# EAGLE design ESP32_Dev_2018-2 (EAGLE 9.2.0)
COMPANY: UNEXPECTED MAKER; DRAWN: SEON; REV: A
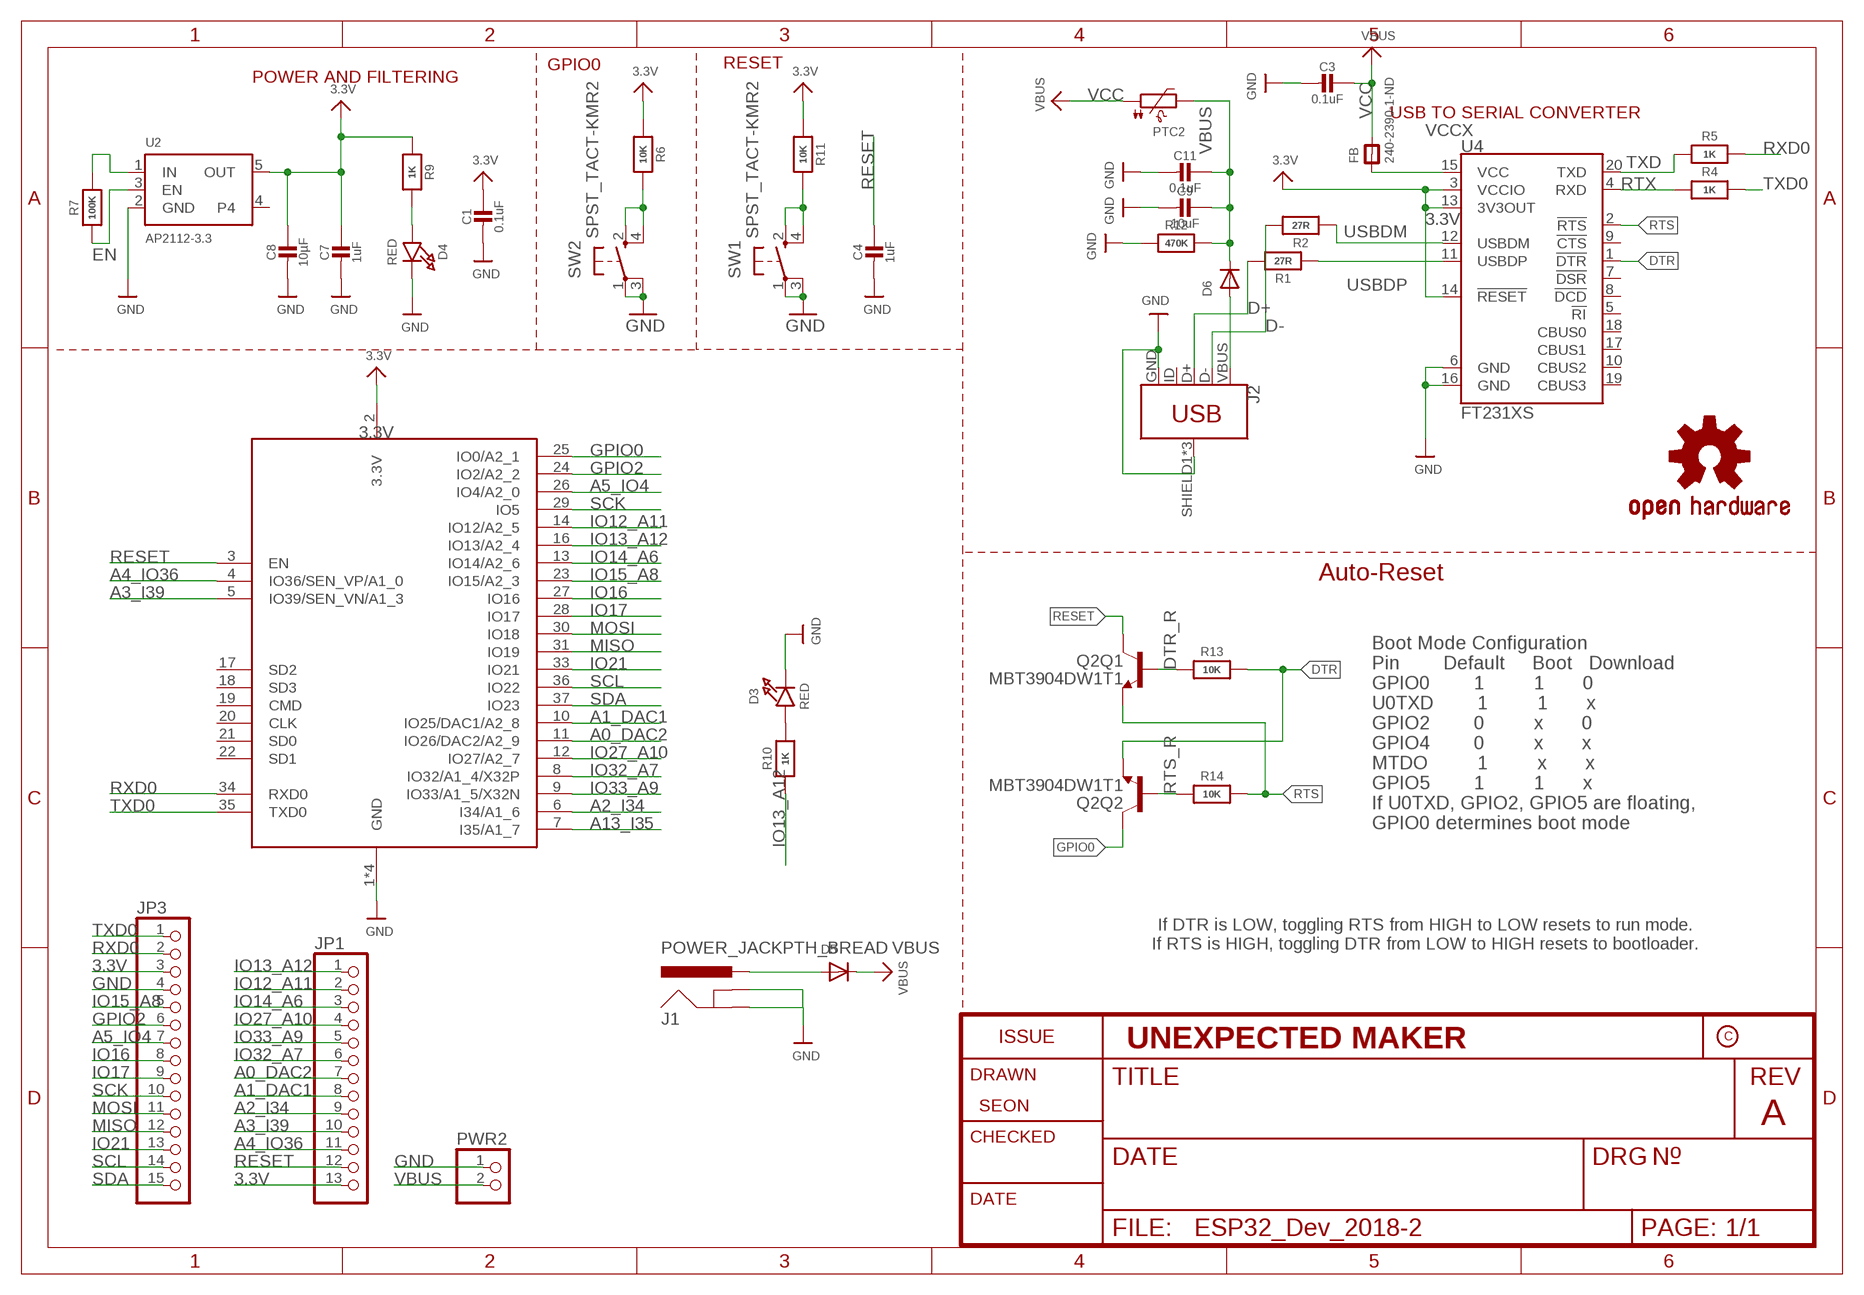
[diagram p0: schematic, sheet 1]

## Parts
C1  0.1uF  CAP_CERAMIC0805-NOOUTLINE  [0805-NO]
C3  0.1uF  CAP_CERAMIC0805-NOOUTLINE  [0805-NO]
C4  1uF  CAP_CERAMIC0805-NOOUTLINE  [0805-NO]
C7  1uF  CAP_CERAMIC0805-NOOUTLINE  [0805-NO]
C8  10µF  CAP_CERAMIC0805-NOOUTLINE  [0805-NO]
C9  10uF  CAP_CERAMIC0805-NOOUTLINE  [0805-NO]
C11  0.1uF  CAP_CERAMIC0805-NOOUTLINE  [0805-NO]
D3  RED  LED0805_NOOUTLINE  [CHIPLED_0805_NOOUTLINE]
D4  RED  LED0805_NOOUTLINE  [CHIPLED_0805_NOOUTLINE]
D5  DIODESOD-123  [SOD-123]
D6  DIODESOD-123  [SOD-123]
FB  240-2390-1-ND  FERRITE_0805  [_0805]
J1  POWER_JACKPTH_BREAD  [POWER_JACK_PTH_BREAD]
J2  USB_MICRO-BREDUCED_PASTE  [USB-B-MICRO-SMD_RED_PASTE]
JP1  HEADER-1X13  [1X13_ROUND_70]
JP3  HEADER-1X15  [1X15_ROUND_70]
LOGO1  OSHW-LOGOM  [OSHW-LOGO-M]
PTC2  PTC1206  [1206]
PWR2  HEADER-1X2ROUND  [1X02_ROUND]
Q2  MBT3904DW1T1  [SC70-6]
R1  27R  RESISTOR0805_NOOUTLINE  [0805-NO]
R2  27R  RESISTOR0805_NOOUTLINE  [0805-NO]
R4  1K  RESISTOR0805_NOOUTLINE  [0805-NO]
R5  1K  RESISTOR0805_NOOUTLINE  [0805-NO]
R6  10K  RESISTOR0805_NOOUTLINE  [0805-NO]
R7  100K  RESISTOR0805_NOOUTLINE  [0805-NO]
R9  1K  RESISTOR0805_NOOUTLINE  [0805-NO]
R10  1K  RESISTOR0805_NOOUTLINE  [0805-NO]
R11  10K  RESISTOR0805_NOOUTLINE  [0805-NO]
R12  470K  RESISTOR0805_NOOUTLINE  [0805-NO]
R13  10K  RESISTOR0805_NOOUTLINE  [0805-NO]
R14  10K  RESISTOR0805_NOOUTLINE  [0805-NO]
SW1  SPST_TACT-KMR2  [KMR2]
SW2  SPST_TACT-KMR2  [KMR2]
U2  AP2112-3.3  VREG_SOT23-5  [SOT23-5]
U4  FT231XS  [SSOP20_L]
X2  ESP32_WROOM32  [WROOM32]

## Nets
3.3V: C1.1 C7.1 C8.1 JP1.13 JP3.3 R6.1 R9.1 R11.1 U2.5(OUT) U4.3(VCCIO) U4.13(3V3OUT) U4.14(!RESET) X2.2(3.3V)
A0_DAC2: JP1.7 X2.11(IO26/DAC2/A2_9)
A1_DAC1: JP1.8 X2.10(IO25/DAC1/A2_8)
A2_I34: JP1.9 X2.6(I34/A1_6)
A3_I39: JP1.10 X2.5(IO39/SEN_VN/A1_3)
A4_IO36: JP1.11 X2.4(IO36/SEN_VP/A1_0)
A5_IO4: JP3.7 X2.26(IO4/A2_0)
A13_I35: X2.7(I35/A1_7)
D+: J2.D+ R1.2
D-: J2.D- R2.2
DTR: Q2.1(Q2:E) R13.2 U4.1(!DTR)
DTR_R: Q2.5(Q1:B) R13.1
EN: R7.1 U2.3(EN)
GND: C1.2 C3.2 C4.2 C7.2 C8.2 C9.2 C11.2 D3.C D4.C J1.GND J1.GNDBREAK J2.GND J2.SHIELD1(SHIELD) J2.SHIELD2(SHIELD) J2.SHIELD3(SHIELD) JP3.4 PWR2.1 R12.1 SW1.1(P) SW1.3(P1) SW2.1(P) SW2.3(P1) U2.2(GND) U4.6(GND) U4.16(GND) X2.1(GND) X2.15(GND) X2.38(GND) X2.P$1(GND)
GPIO0: Q2.6(Q2:C) R6.2 SW2.2(S) SW2.4(S1) X2.25(IO0/A2_1)
GPIO2: JP3.6 X2.24(IO2/A2_2)
IO12_A11: JP1.2 X2.14(IO12/A2_5)
IO13_A12: JP1.1 R10.1 X2.16(IO13/A2_4)
IO14_A6: JP1.3 X2.13(IO14/A2_6)
IO15_A8: JP3.5 X2.23(IO15/A2_3)
IO16: JP3.8 X2.27(IO16)
IO17: JP3.9 X2.28(IO17)
IO21: JP3.13 X2.33(IO21)
IO27_A10: JP1.4 X2.12(IO27/A2_7)
IO32_A7: JP1.6 X2.8(IO32/A1_4/X32P)
IO33_A9: JP1.5 X2.9(IO33/A1_5/X32N)
MISO: JP3.12 X2.31(IO19)
MOSI: JP3.11 X2.30(IO18)
N$1: D6.A J2.VBUS
N$5: D3.A R10.2
N$10: D4.A R9.2
RESET: C4.1 JP1.12 Q2.3(Q1:C) R11.2 SW1.2(S) SW1.4(S1) X2.3(EN)
RTS: Q2.4(Q1:E) R14.2 U4.2(!RTS)
RTS_R: Q2.2(Q2:B) R14.1
RTX: R4.1 U4.4(RXD)
RXD0: JP3.2 R5.2 X2.34(RXD0)
SCK: JP3.10 X2.29(IO5)
SCL: JP3.14 X2.36(IO22)
SDA: JP3.15 X2.37(IO23)
TXD: R5.1 U4.20(TXD)
TXD0: JP3.1 R4.2 X2.35(TXD0)
USBDM: R2.1 U4.12(USBDM)
USBDP: R1.1 U4.11(USBDP)
VBUS: C9.1 C11.1 D5.C D6.C PTC2.2 PWR2.2 R12.2
VBUS1: D5.A J1.PWR
VCC: C3.1 FB.2 PTC2.1 R7.2 U2.1(IN) ; supply symbol labelled VBUS
VCCX: FB.1 U4.15(VCC)
Unconnected: J2.ID U2.4 U4.5(!RI) U4.7(!DSR) U4.8(!DCD) U4.9(!CTS) U4.10(CBUS2) U4.17(CBUS1) U4.18(CBUS0) U4.19(CBUS3) X2.17(SD2) X2.18(SD3) X2.19(CMD) X2.20(CLK) X2.21(SD0) X2.22(SD1)

## Notes on the sheet
- GPIO0 | RESET
- POWER AND FILTERING
- USB TO SERIAL CONVERTER
- Auto-Reset
- Boot Mode Configuration
  Pin        Default     Boot   Download
  GPIO0        1         1       0
  U0TXD        1         1       x
  GPIO2        0         x       0
  GPIO4        0         x       x
  MTDO         1         x       x
  GPIO5        1         1       x
  If U0TXD, GPIO2, GPIO5 are floating, 
  GPIO0 determines boot mode
- If DTR is LOW, toggling RTS from HIGH to LOW resets to run mode.
  If RTS is HIGH, toggling DTR from LOW to HIGH resets to bootloader.

## Library data of the parts
C1 C3 C4 C7-C9 C11 = microbuilder:CAP_CERAMIC: Ceramic Capacitors For new designs, use the packages preceded by an '_' character since they are more reliable: The following footprints should be used on most boards: _0402 - Standard footprint for regular board layouts _0603 - Standard footprint for regular board layouts _0805 - Standard footprint for regular board layouts _1206 - Standard footprint for regular board layouts For extremely tight-pitch boards where space is at a premium, the following 'micro-pitch' footprints can be used (smaller pads, no silkscreen outline, etc.): _0402MP - Micro-pitch footprint for very dense/compact boards _0603MP - Micro-pitch footprint for very dense/compact boards _0805MP - Micro-pitch footprint for very dense/compact boards _1206MP - Micro-pitch footprint for very dense/compact boards
D3 D4 = microbuilder:LED: LED 0603 - 0603 Surface Mount Package 2mA: Green LED - Low Power (3.9mcd, 2ma, 1.7Vf) - Digikey: 475-2709-2-ND Orange LED - Low Power (9.8mcd, 2ma, 1.8Vf) - Digikey: 475-1194-2-ND Red LED - Low Power (5mcd, 2ma, 1.8Vf) - Digikey: 475-1195-2-ND Yellow LED - Low Power (7mcd, 2ma, 1.8Vf) - Digikey: 475-1196-2-ND 5mA: Blue LED - Low Power (17mcd, 5ma, 2.9Vf) - Digikey: LNJ937W8CRACT-ND 0805 - 0805 Surface Mount Package 2mA: Red LED (8.8mcd, 2mA, 1.8Vf, Clear) - Low Power [Digikey: 475-2510-1-ND] Green LED (5mcd, 2mA, 1.8Vf, Clear) - Low Power [Digikey: 475-2730-1-ND] Yellow LED (11.3mcd, 2mA, 1.8Vf, Clear) - Low Power [Digikey: 475-2555-1-ND] 20mA: Red LED (104mcd, 20mA, Diffused) - LS R976 [Digikey: 475-1278-6-ND] Red LED (12mcd, 20mA, 2.0Vf, Clear) - APT2012EC [Digikey: 754-1128-1-ND] Green LED (15mcd, 20mA, 2.2Vf, Clear) - APT2012GC [Digikey: 754-1131-1-ND] Orange LED (160mcd, 20mA, 2.1Vf, Clear) - APT2012SECK [Digikey: 754-1130-1-ND] 1206 - 1206 Surface Mount Package Green LED (26mcd, 20mA, Diffused) - LG N971 [Digikey: 475-1407-6-ND] Red LED (15mcd, 20mA, Diffused) - LH N974 [Digikey: 475-1416-6-ND] Cree - Cree High-Power Surface Mount LEDs XPEBWT-L1-0000-00D50 - White 111lm 350mA 2.9Vf 6200K 110° XTEAWT-00-0000-00000LEE3 - White 114lm 350mA 2.85Vf 5000K 115° Everlight - Everlight 45-21 Series Surface Mount LEDs 45-21/QK2C-B2832AC2CB2/2T - Warm White 2000mcd 20mA 3.25Vf 3050K 120° 45-21/LK2C-B38452C4CB2/2T - Nuetral White 2000mcd 20mA 3.25Vf 4150K 120° 45-21/LK2C-B50634C6CB2/2T - Cold White 2200mcd 20mA 3.25Vf 5650K 120° PLCC2 Reverse Mount LS T77K-J1L2-1-0-2-R18-Z - Red 11.25mcd 2mA 1.8Vf 630nm 120° LO T77K-L1M2-24-Z - Orange 19.6mcd 2mA 1.8Vf 606nm 120° LY T77K-K2M1-26-Z - Yellow 15.7mcd 2mA 1.8Vf 587nm 120°
D5 D6 = microbuilder:DIODE: Diode SMA Model Volts Amps Type Vf Vr Digikey # Notes SSA34-E3 40V 3A Schottky 480mV @ 3A 200uA @ 40V SSA34-E3/61TGITR-ND CDBA120-G 20V 1A Schottky 500mV @ 1A 500uA @ 20V 641-1014-6-ND REEL MBRA210 10V 2A Schottky 350mV @ 2A 700uA @ 10V MBRA210LT3 SOD-123 Model Volts Amps Type Vf Vr Order # Notes BAT54T1G 30V 200mA Schottky 800mV @ 200mA 2uA @ 25V BAT54T1GOSTR-ND B0530W 30V 500mA Schottky 430mV @ 500mA 130uA @ 30V B0530W-FDICT-ND REEL MBR120 1A 20V Schottky 340mV @ 1A MBR120VLSFT1GOSCT-ND SOD-323 Model Volts Amps Type Vf Vr Order # Notes PMEG2005EJ 20V 500mA Schottky 355mV @ 500mA 568-4110-1-ND ZLLS410 10V 570mA Schottky 380mV @ 570mA ZLLS410CT-ND 1N4148WS 75V 150mA Silicon/Simple 1V 1N4148WSFSCT-ND REEL SOD-523 Model Volts Amps Type Vf Vr Order # Notes BAT54XV2 30V 200mA Schottky 0.8V @ 100mA BAT54XV2CT-ND TB751S 30V 30mA Schottky RB751S-40TE61CT-ND SOT23-R/W (R = Solder Paste/Reflow Ovens, W = Hand-Soldering) Model Volts Amps Type Vf Vr Order # Notes BAT54FILM 40V 300mA Schottky 497-7162-1-ND
FB = microbuilder:FERRITE: Ferrite Bead 0603 MMZ1608B121C - 120 Ohm @ 100MHz, 600mA, 0.15 Ohm DC Resistance - Digikey: 445-2164-1-ND BK1608HW121-T - 120 Ohm, 600mA Ferrite Chip - Digikey: 587-1876-2-ND 0805 HZ0805B272R-10 - 2.7K Ohm @ 100MHz, 200mA, 0.8 Ohm DC Resistance - Digikey: 240-2504-1-ND (see also Murata BLM21BD272SN1L) MMZ2012Y152B - 1.5K Ohm @ 100MHz, 500mA, 0.4 Ohm DC Resistance - Digikey: 445-1560-1-ND - Mainly for high frequency (80-400MHz) MMZ2012R102A - 1K Ohm @ 100MHz, 500mA, 0.3 Ohm DC Resistance - Digikey: 445-1555-2-ND - More general purpose (10-200MHz)
J1 = SparkFun-Connectors:POWER_JACK: Power Jack Connector This is the standard 5.5mm barrel jack for power. The PTH is the most common, proven, reliable, footprint. The Slot footprint only works if the mill layer is transmitted to the PCB fab house so be warned. Here are the connectors we sell at SparkFun: DC Barrel Power Jack/Connector <https://www.sparkfun.com/products/119> (PRT-00119) DC Barrel Power Jack/Connector (SMD) <https://www.sparkfun.com/products/12748> (PRT-12748) DC Barrel Jack Adapter - Breadboard Compatible <https://www.sparkfun.com/products/10811> (PRT-10811) It is used on this SparkFun product (and many, many others): SparkFun RedBoard - Programmed with Arduino <https://www.sparkfun.com/products/12757> (DEV-12757) Also, if you need a mating power supply or connector, please check these out: Wall Adapter Power Supply - 9VDC 650mA <https://www.sparkfun.com/products/298> (TOL-00298) DC Barrel Jack Adapter - Male <https://www.sparkfun.com/products/10287> (PRT-10287); PROD_ID: PRT-10811
J2 = SparkFun-Connectors:USB_MICRO-B: USB Type Micro-B Connector Male/female and PTH/SMT variants SparkFun Products: SparkFun microB USB Breakout <https://www.sparkfun.com/products/12035> SparkFun USB microB Plug Breakout <https://www.sparkfun.com/products/10031> SparkFun ESP8266 Thing <https://www.sparkfun.com/products/13231>; PROD_ID: CONN-11752
JP1 = microbuilder:HEADER-1X13
JP3 = microbuilder:HEADER-1X15: 1x15 Header
LOGO1 = SparkFun-Aesthetics:OSHW-LOGO: Open-Source Hardware (OSHW) Logo This logo indicates the piece of hardware it is found on incorporates a OSHW license and/or adheres to the definition of open source hardware found here: http://freedomdefined.org/OSHW
PTC2 = microbuilder:PTC: PTC (Resettable Fuse) 1206 Package 250mA PTC (16V Max, Time-to-Trip: 0.08s) - Digikey: F2110CT-ND 1210 Package 100mA PTC (30V Max, Time-to-Trip: 0.6s) - Digikey: MF-USMF010-2CT-ND 1812 Package 750mA PTC (24V Max, Time-to-Trip: 0.2s) - Digikey: MF-MSMF075/24-2CT-ND
PWR2 = microbuilder:HEADER-1X2: PIN HEADER
Q2 = esp32-thing-temp:MBT3904DW1T1: MBT3904DW1 Dual NPN Transistors The MBT3904W1 puts two general purpose 3904 NPN transistors in a single package. Datasheet <http://www.onsemi.com/pub_link/Collateral/MBT3904DW1T1-D.PDF>; PROD_ID: TRANS-13337
R1 R2 R4-R7 R9-R14 = microbuilder:RESISTOR: Resistors For new designs, use the packages preceded by an '_' character since they are more reliable: The following footprints should be used on most boards: _0402 - Standard footprint for regular board layouts _0603 - Standard footprint for regular board layouts _0805 - Standard footprint for regular board layouts _1206 - Standard footprint for regular board layouts For extremely tight-pitch boards where space is at a premium, the following 'micro-pitch' footprints can be used (smaller pads, no silkscreen outline, etc.): _0402MP - Micro-pitch footprint for very dense/compact boards _0603MP - Micro-pitch footprint for very dense/compact boards _0805MP - Micro-pitch footprint for very dense/compact boards _1206MP - Micro-pitch footprint for very dense/compact boards
SW1 SW2 = adafruit:SPST_TACT: SMT 6mm switch, EVQQ2 series http://www.ladyada.net/library/eagle
U2 = microbuilder:VREG_SOT23-5: SOT23-5 Fixed Voltage Regulators Part Current Out V Out V In V Dropout θJA (°C/W) TJ (°C) Digikey Part No. ADP121 150mA 3.3V 3.4-5.5V 0.09V @ 150mA -- -- ADP121-AUJZ33R7CT-ND ADP121 150mA 3.0V 3.1-5.5V 0.09V @ 150mA -- -- ADP121-AUJZ30R7CT-ND ADP122 300mA 3.3V 3.4-5.5V 0.085V @ 300mA -- -- ADP122AUJZ-3.3-R7CT-ND ADP1712 300mA 3.3V 3.5-5.5V 0.17V @ 300mA -- -- ADP1712AUJZ-3.3-R7TR-ND AP7311 (Low Cost) 150mA 3.3V 3.5-6V 0.15V @ 150mA -- -- AP7311-33WG-7DICT-ND LD39015M18R 150mA 1.8V 1.9V-5.5V 0.08V @ 100mA -- -- 497-6977-1-ND LP2985A-33DBVR 150mA 3.3V 3.3-16V 0.28V @ 150mA 206 150 296-18479-1-ND MCP1824T-3302E/OT 300mA 3.3V 3.5V-6V 0.2V @ 300mA -- -- MCP1824T-3302E/OTCT-ND MIC5205-2.5YM5 TR 150mA 2.5V 2.7-16V 0.165V @ 150mA -- -- 576-1257-2-ND MIC5205-3.0YM5 TR 150mA 3.0V 3.2V-16V 0.165V @ 150mA -- -- 576-1258-2-ND MIC5205-3.3YM5 TR 150mA 3.3V 3.5V-16V 0.165V @ 150mA -- -- 576-1259-2-ND TPS780330220 150mA 3.3V+2.2V 3.6-5.5V 250mV Max -- -- 296-23332-1-ND TDA3663/N1,135 100mA 3.3V 3.5-45V 0.18V @ 50mA -- -- 568-5343-1-ND Max operating temp can be calculated using θJA, TJ (max junction temperature), and power in watts. Set the "Maximum Ambient Temperature" until it reaches TJ ("Max Junction Temperature"), which is the absolute limit for safe use of the regulator: Heat Sink Temperature Calculator <http://www.daycounter.com/Calculators/Heat-Sink-Temperature-Calculator.phtml> For example, With 12V source into a 3.3V LP2985 and a 30mA load, we are dissipating (12V-3.3V) * 0.03A = 0.261W. With a θJA of 206 °C/W, a TJ of 150°C, and 261mW we can safely use the chip without a heat sink up to 75°C (=147.1°C Junction Temperature).
U4 = SparkFun-DigitalIC:FT231X: FTDI FT231X Full Speed USB to Full-handshake UART This USB2.0 Full Speed IC offers a compact bridge to full handshake UART interfaces. The device is a UART, capable of operating up to 3MBaud, with low power consumption (8mA). The FT231X includes the complete FT-X series feature set and enables USB to be added into a system design quickly and easily over a UART interface.; PROD_ID: IC-11524
X2 = microbuilder:ESP32_WROOM32

## Board
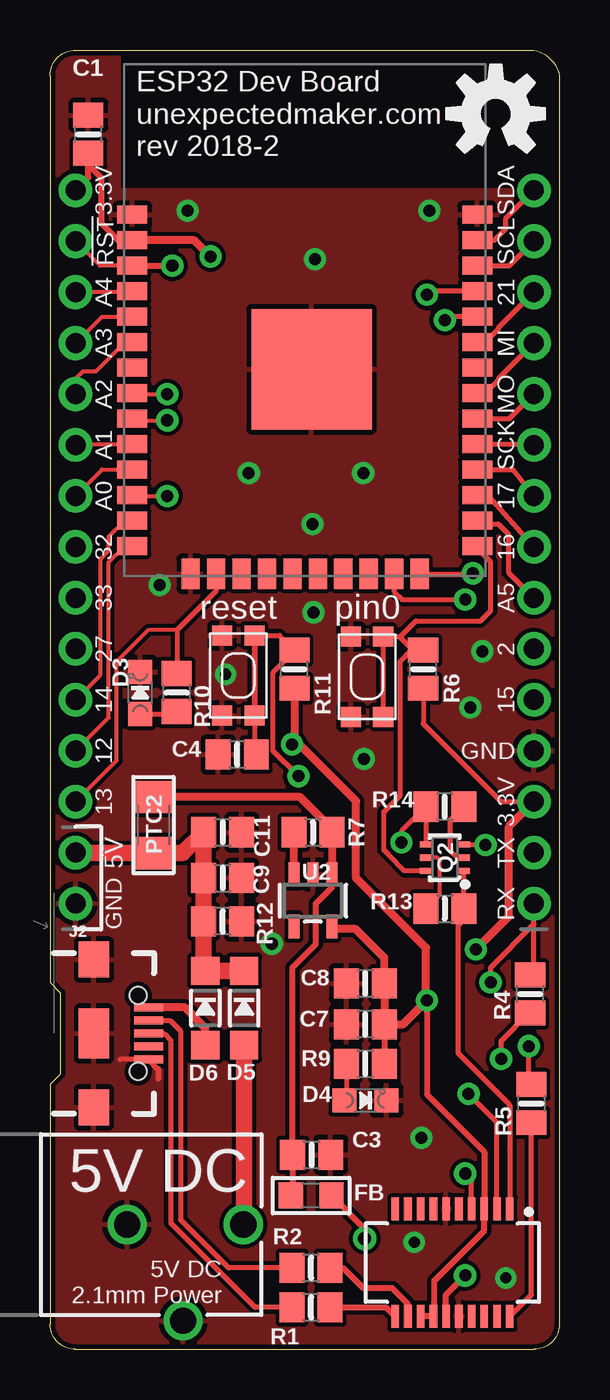
[diagram p1: board, top side]
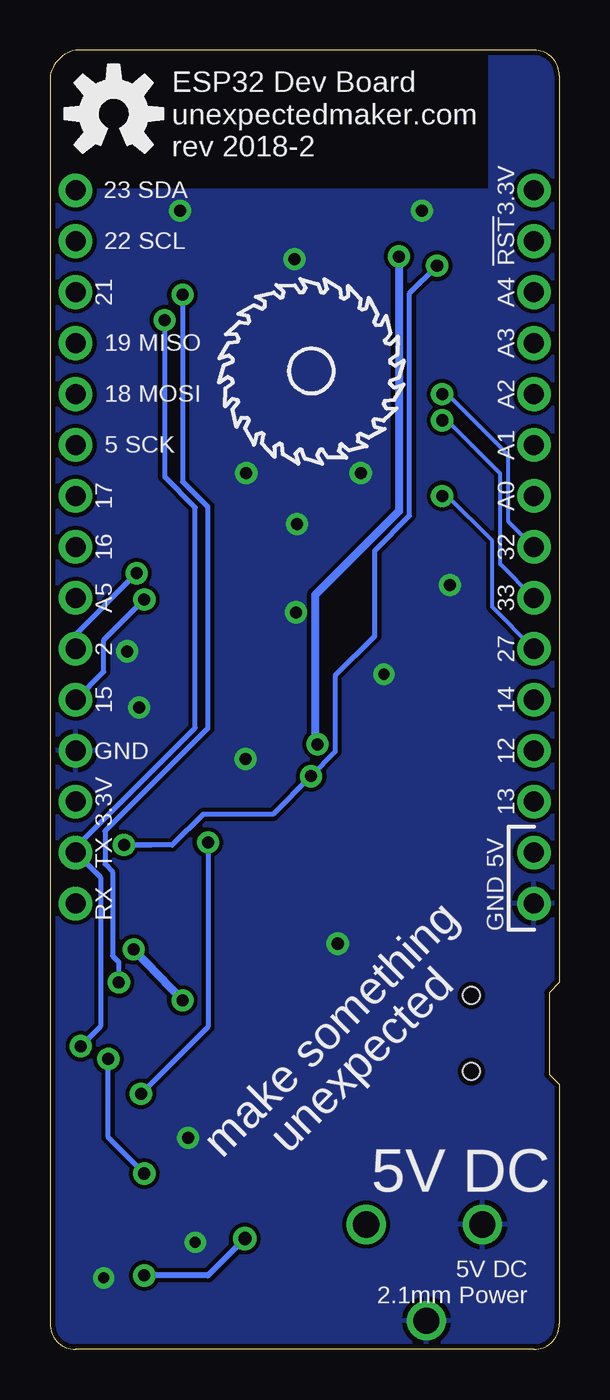
[diagram p2: board, bottom side, seen from below]

Size 25.4 x 64.77 mm. Coordinates in mm from the lower left corner, seen from the top.
Outline: 1.27,0 24.13,0 arc90 25.4,1.27 25.4,63.5 arc67 24.13,64.77 1.27,64.77 arc90 0,63.5 0,18.29 0.51,17.78 0.51,13.72 0,13.21 0,1.27 arc90 1.27,0
Copper layers (1*16): Top 0.035mm / dielectric 1.5mm / Bottom 0.035mm
Design rules "SparkFun": minimum track width 8mil, minimum drill 20mil, track to track 8mil, track to pad 8mil, pad to pad 8mil, via to via 8mil, smd to smd 8mil, copper to edge 10mil, drill to drill 8mil, minimum pad ring 12mil, minimum via ring 10mil, stop-mask expansion 4mil, vias tented up to drill 25mil, thermal gap 10mil

### Footprints (pad centres in the part's own frame; a part is rotated, then mirrored left to right if it is on the bottom)
0805-NO = smd 1.24 x 1.5: 1 -0.95,0; 2 0.95,0
CHIPLED_0805_NOOUTLINE = smd 1.2 x 1.2: A 0,-1.05; C 0,1.05
SOD-123 = smd 1.4 x 1.4: A 1.85,0; C -1.85,0
_0805 = smd 1.2 x 1.3: 1 -1.016,0; 2 1.016,0
POWER_JACK_PTH_BREAD = drill 1.3: GND 0,7.9; GNDBREAK 4.8,10.7; PWR 0,13.7
USB-B-MICRO-SMD_RED_PASTE = smd 1.45 x 0.4: D+ 2.725,0; D- 2.725,0.65; GND 2.725,-1.3; ID 2.725,-0.65; VBUS 2.725,1.3 | smd 1.5 x 1.8: SHIELD1 0,3.685; SHIELD2 0,-3.685 | smd 1.5 x 2.5: SHIELD3 0,0 | hole 0.85: 2.2,1.9; 2.2,-1.9
1X13_ROUND_70 = drill 1 pad 1.676: 1 -15.24,0; 2 -12.7,0; 3 -10.16,0; 4 -7.62,0; 5 -5.08,0; 6 -2.54,0; 7 0,0; 8 2.54,0; 9 5.08,0; 10 7.62,0; 11 10.16,0; 12 12.7,0; 13 15.24,0
1X15_ROUND_70 = drill 1 pad 1.676: 1 -17.78,0; 2 -15.24,0; 3 -12.7,0; 4 -10.16,0; 5 -7.62,0; 6 -5.08,0; 7 -2.54,0; 8 0,0; 9 2.54,0; 10 5.08,0; 11 7.62,0; 12 10.16,0; 13 12.7,0; 14 15.24,0; 15 17.78,0
1206 = smd 1.6 x 1.8: 1 -1.4,0; 2 1.4,0
1X02_ROUND = drill 1 pad 1.676: 1 -1.27,0; 2 1.27,0
SC70-6 = smd 0.3 x 0.66: 1 -0.65,-0.92; 2 0,-0.92; 3 0.65,-0.92; 4 0.65,0.92; 5 0,0.92; 6 -0.65,0.92
KMR2 = smd 1 x 1: 1 2,0.8; 2 2,-0.8; 3 -2,0.8; 4 -2,-0.8
SOT23-5 = smd 0.55 x 1.2: 1 -0.95,-1.3; 2 0,-1.3; 3 0.95,-1.3; 4 0.95,1.3; 5 -0.95,1.3
SSOP20_L = smd 0.381 x 1.143: 1 -2.857,-2.68; 2 -2.223,-2.68; 3 -1.587,-2.68; 4 -0.953,-2.68; 5 -0.318,-2.68; 6 0.318,-2.68; 7 0.953,-2.68; 8 1.587,-2.68; 9 2.223,-2.68; 10 2.857,-2.68; 11 2.857,2.68; 12 2.223,2.68; 13 1.587,2.68; 14 0.953,2.68; 15 0.318,2.68; 16 -0.318,2.68; 17 -0.953,2.68; 18 -1.587,2.68; 19 -2.223,2.68; 20 -2.857,2.68
WROOM32 = smd 1.5 x 0.9: 1 -8.6,5; 2 -8.6,3.73; 3 -8.6,2.46; 4 -8.6,1.19; 5 -8.6,-0.08; 6 -8.6,-1.35; 7 -8.6,-2.62; 8 -8.6,-3.89; 9 -8.6,-5.16; 10 -8.6,-6.43; 11 -8.6,-7.7; 12 -8.6,-8.97; 13 -8.6,-10.24; 14 -8.6,-11.51; 25 8.6,-11.51; 26 8.6,-10.24; 27 8.6,-8.97; 28 8.6,-7.7; 29 8.6,-6.43; 30 8.6,-5.16; 31 8.6,-3.89; 32 8.6,-2.62; 33 8.6,-1.35; 34 8.6,-0.08; 35 8.6,1.19; 36 8.6,2.46; 37 8.6,3.73; 38 8.6,5 | smd 0.9 x 1.5: 15 -5.7,-12.9; 16 -4.43,-12.9; 17 -3.16,-12.9; 18 -1.89,-12.9; 19 -0.62,-12.9; 20 0.65,-12.9; 21 1.92,-12.9; 22 3.19,-12.9; 23 4.46,-12.9; 24 5.73,-12.9 | smd 6 x 6: P$1 0.34,-2.7

### Placement (x,y rotation side)
C1  1.9,60.58 90 top
C3  13.04,9.7 0 top
C4  9.33,29.65 180 top
C7  15.72,16.2 180 top
C8  15.72,18.24 180 top
C9  8.6,23.5 0 top
C11  8.6,25.78 0 top
D3  4.5,32.73 0 top
D4  15.72,12.41 270 top
D5  9.68,17.02 270 top
D6  7.74,17.02 270 top
FB  13.02,7.67 180 top
J1  -4.06,6.22 270 top
J2  2.18,15.75 0 top
JP1  1.27,42.55 90 top
JP3  24.13,40.01 90 top
LOGO1  22.23,61.59 0 bottom
LOGO2  OSHW-LOGOM  [OSHW-LOGO-M]  22.23,61.59 0 top
PTC2  5.16,26.14 270 top
PWR2  1.27,23.5 90 top
Q2  19.68,24.51 90 top
R1  13.02,2.1 180 top
R2  13.02,4.06 180 top
R4  23.94,17.72 90 top
R5  24,12.26 90 top
R6  18.61,33.91 90 top
R7  13.11,25.78 0 top
R9  15.72,14.22 180 top
R10  6.3,32.74 270 top
R11  12.18,33.91 90 top
R12  8.6,21.34 180 top
R13  19.68,21.97 0 top
R14  19.68,27.05 180 top
SW1  9.39,33.59 90 top
SW2  15.81,33.53 90 top
U2  13.11,22.38 180 top
U4  20.07,4.32 180 top
X2  12.7,51.56 0 top

### Tracks (layer width: path | path; a pad name or v marks a point on that pad's centre or on a via)
3.3V  (via drill 0.6)
  Top 0.254: 4.43,55.24 X2.2 4.05,55.24 | JP3.3 22.48,27.3 18.61,31.18 R6.1
  Top 0.305: U4.13 U4.14 19.16,1.68 19.16,3.42 21.65,5.92 U4.3 21.65,9.84 18.8,12.7 v18.8,17.4 | X2.2 3.38,55.29 2.54,56.13 2.54,58.42 1.9,59.05 C1.1 | 2.29,59.76 C1.1 | C1.1 1.9,58.42 JP1.13 | C7.1 R9.1
  Top 0.406: v8,54.48 7.19,55.29 X2.2 | v21.23,19.94 22.89,21.59 22.89,26.06 JP3.3 | U2.5 14.18,20.95 15.24,20.95 16.67,19.52 C8.1 C7.1 17.6,16.2 v18.8,17.4 18.75,17.45 18.75,20.02 15.26,23.5 15.26,27.33 12.43,30.16 v12.07,30.16 12.18,30.28 R11.1
  Bottom 0.406: v8,54.48 8,41.78 12.18,37.61 12.18,30.27 v12.07,30.16 | v21.23,19.94 v18.8,17.4
A0_DAC2
  Top 0.203: JP1.7 2.59,43.86 X2.11
  Top 0.254: X2.11 4.24,43.86
A1_DAC1
  Top 0.203: X2.10 1.32,45.13 JP1.8
  Top 0.254: 4.05,45.09 X2.10
A2_I34
  Top 0.203: X2.6 3.73,50.21 2.29,48.77 1.65,48.77 1.27,48.39 JP1.9
A3_I39
  Top 0.203: X2.5 2.59,51.48 JP1.10
A4_IO36
  Top 0.203: X2.4 4.05,52.7 JP1.11
A5_IO4
  Top 0.254: X2.26 21.47,41.15 22.35,41.15 22.86,40.64 22.86,38.73 JP3.7
D+
  Top 0.254: R1.2 10.22,2.1 6.02,6.3 6.02,15.41 5.68,15.75 J2.D+
D-
  Top 0.254: R2.2 8.9,4.06 6.5,6.46 6.5,15.88 5.98,16.4 J2.D-
DTR
  Top 0.254: Q2.1 20.61,22 R13.2 20.64,21.4 20.35,21.11 20.35,14.76 22.93,12.19 22.93,12.07 22.92,12.06 22.92,9.91 22.93,9.91 22.93,6.87 U4.1
DTR_R
  Top 0.203: R13.1 19.43,22.67 19.43,24.38 19.3,24.51 Q2.5
EN
  Top 0.406: U2.3 R7.1
GND  (via drill 0.55, 0.6)
  Top 0.254: J2.GND 3.48,14.45
  Top 0.305: J2.GND 5.4,13.96 5.4,13.49
  other vias: 5.46,38.1 18.92,56.77 13.21,54.36 15.62,43.69 22.73,3.56 18.16,5.33 18.52,10.54 13.14,36.74 20.96,32 9.91,43.69 13.08,41.15 6.86,56.77 21.56,34.8 8.75,33.66 11.06,20.22 15.66,29.43
  pour Top: -2.54,68.58 -4.45,66.67 -4.45,-1.27 -3.81,-1.91 29.21,-1.91 29.84,-1.27 29.84,57.78 3.45,57.78 3.45,67.31 2.54,68.58
  pour Bottom: -3.81,67.31 -3.81,0 -1.91,-1.91 28.57,-1.91 28.57,57.78 3.45,57.78 3.45,67.94 3.18,68.58 -2.54,68.58
GPIO0
  Top 0.203: 21.04,39.8 X2.25
  Top 0.254: X2.25 21.3,39.91 21.97,39.24 21.97,36.83 21.46,36.32 18.26,36.32 17.46,35.53 SW2.2 | Q2.6 17.67,23.86 16.89,24.64 16.89,24.66 16.64,24.91 16.64,26.8 17.47,27.62 17.47,34.29 17.46,34.29 18.03,34.86 18.1,34.86 | SW2.2 SW2.4 | SW2.2 17.43,35.53 18.1,34.86 | 18.1,34.86 R6.2
GPIO2  (via drill 0.6)
  Top 0.254: v21.09,38.69 21.06,38.66 X2.24
  Bottom 0.254: JP3.6 24.13,35.65 v21.09,38.69
IO12_A11
  Top 0.203: X2.14 3.73,40.05 2.92,39.24 2.92,31.5 JP1.2
IO13_A12
  Top 0.203: JP1.1 3.33,29.36 3.33,34.29 4.91,35.88 6.35,35.88
  Top 0.254: R10.1 6.35,33.74 6.35,35.88 8.27,37.8 X2.16
IO14_A6
  Top 0.203: X2.13 3.73,41.32 2.92,40.51 2.92,39.82 2.52,39.41 2.52,33.66 2.52,33.63 JP1.3
IO15_A8  (via drill 0.6)
  Top 0.254: 17.16,38.34 X2.23 17.16,37.79 17.57,37.38 v20.7,37.38
  Bottom 0.254: JP3.5 22.73,33.79 22.73,35.35 v20.7,37.38
IO16
  Top 0.254: X2.27 21.8,42.59 JP3.8
IO17
  Top 0.254: X2.28 23.07,43.86 JP3.9
IO21
  Top 0.254: JP3.13 22.38,50.95 22.38,50.9 21.7,50.21 X2.33
IO27_A10  (via drill 0.6)
  Top 0.203: X2.12 4.15,42.55 v5.84,42.55
  Bottom 0.203: v5.84,42.55 5.59,42.55 3.35,40.31 3.35,37.01 JP1.4
IO32_A7  (via drill 0.6)
  Top 0.203: X2.8 4.15,47.62 v5.84,47.62
  Bottom 0.203: v5.84,47.62 5.59,47.62 2.59,44.63 2.54,44.58 2.54,41.27 JP1.6
IO33_A9  (via drill 0.6)
  Top 0.203: X2.9 4.19,46.31 v5.84,46.31
  Bottom 0.203: v5.84,46.31 5.59,46.31 2.95,43.67 2.95,39.14 JP1.5
MISO
  Top 0.254: JP3.12 22.38,48.41 22.38,48.35 21.7,47.67 X2.31
MOSI
  Top 0.254: X2.30 22.91,46.4 JP3.11
N$1
  Top 0.406: D6.A 7.74,16.03 6.72,17.05 J2.VBUS
N$5
  Top 0.254: D3.A 6.19,31.68 R10.2
N$10
  Top 0.254: R9.2 14.77,12.51 D4.A
RESET  (via drill 0.6)
  Top 0.203: X2.3 2.49,54.02 JP1.12
  Top 0.254: SW1.4 10.2,30.06 C4.1 | Q2.3 21.65,25.16 v21.72,25.15 | 12.45,34.86 R11.2 | v12.38,28.57 11.1,29.86 11.1,33.72 12.18,34.8 R11.2 | SW1.2 11.45,35.59 R11.2
  Top 0.305: SW1.2 SW1.4 | X2.3 v6.1,54.02
  Bottom 0.254: 20.37,25.15 v21.72,25.15 19.3,25.15 17.78,26.67 14.29,26.67 v12.38,28.57 12.38,28.59 11.18,29.8 11.18,33.59 9.21,35.56 9.21,39.82 7.47,41.56 7.47,52.65 v6.1,54.02
RTS  (via drill 0.6)
  Top 0.254: Q2.4 18.77,27.02 R14.2 17.53,25.84 v17.53,25.27 | U4.2 22.29,11.32 v20.87,12.74
  Bottom 0.254: v17.53,25.27 17.53,16.08 v20.87,12.74
RTS_R
  Top 0.254: R14.1 19.95,26.36 19.95,24.87 20.31,24.51 Q2.2
RTX  (via drill 0.6)
  Top 0.254: v20.7,8.76 20.71,8.67 21.02,8.37 U4.4 | R4.1 23.88,16.77 22.5,15.39 v22.5,14.48
  Bottom 0.254: v20.7,8.76 22.5,10.56 v22.5,14.48
RXD0  (via drill 0.6)
  Top 0.254: X2.34 19.86,51.48 v19.68,51.31 | R5.2 23.88,13.33 v23.88,15.11
  Top 0.305: R5.2 24.26,13.46
  Bottom 0.254: v19.68,51.31 19.68,43.5 18.16,41.98 18.16,30.99 24.13,25.02 JP3.2 22.86,23.5 22.86,16.13 v23.88,15.11
SCK
  Top 0.254: 21.38,45.21 X2.29 24.18,45.13 JP3.10
SCL
  Top 0.254: X2.36 22.91,54.02 JP3.14
SDA
  Top 0.254: X2.37 22.14,55.29 22.73,55.88 22.73,56.39 JP3.15
TXD
  Top 0.254: U4.20 24,2.72 R5.1
TXD0  (via drill 0.6)
  Top 0.254: X2.35 18.97,52.75 v18.8,52.58 | R4.2 24.13,18.86 JP3.1 24.13,21.21 21.97,19.05 v21.97,18.29
  Bottom 0.254: v18.8,52.58 v18.8,52.57 18.8,43.26 17.53,41.99 17.53,30.98 22.66,25.84 22.66,24.19 22.29,23.81 22.29,19.62 21.97,19.3 v21.97,18.29
USBDM
  Top 0.305: R2.1 14.61,4.06 15.62,3.05 17.06,3.05 17.84,2.27 U4.12
USBDP
  Top 0.305: R1.1 16.75,2.1 U4.11
VBUS
  Top 0.813: D5.C D6.C 7.81,18.95 7.65,19.11 R12.2 C9.1 C11.1 6.61,24.74 PTC2.2 1.3,24.74 PWR2.2
  Top 1.016: 7.67,25.63 C11.1
VBUS1
  Top 0.813: D5.A 9.68,6.26 J1.PWR
VCC
  Top 0.305: FB.2 12.09,7.76 C3.1 12.09,19.05 13.26,20.22 13.26,22.23 14.06,23.02 U2.1
  Top 0.406: 12.07,9.73 C3.1 | U2.1 R7.2 14.06,25.95 12.47,27.54 PTC2.1
VCCX  (via drill 0.6, 0.65)
  Top 0.305: U4.15 19.75,2.73 v20.7,3.68 | FB.1 15.68,6.02 v15.68,5.52
  Bottom 0.305: 15.62,5.59 v15.68,5.52 17.53,3.68 v20.7,3.68

### Text on the board
tPlace: ESP32 Dev Board / unexpectedmaker.com / rev 2018-2 | 3.3V | SDA | !RST! | SCL | A4 | 21 | A3 | MI | A2 | MO | A1 | SCK | A0 | 17 | 32 | 16 | 33 | reset | pin0 | A5 | 27 | 2 | 14 | 15 | 12 | GND | 13 | 3.3V | 5V | TX | GND | RX | 5V DC | 5V DC / 2.1mm Power
bPlace: ESP32 Dev Board / unexpectedmaker.com / rev 2018-2 | 3.3V | 23 SDA | !RST! | 22 SCL | A4 | 21 | A3 | 19 MISO | A2 | 18 MOSI | A1 | 5 SCK | A0 | 17 | 32 | 16 | 33 | A5 | 27 | 2 | 14 | 15 | 12 | GND | 13 | 3.3V | 5V | TX | GND | RX | make something / unexpected | 5V DC | 5V DC / 2.1mm Power